# Altium schematic sheet CoreBoard1.SchDoc: MCU 1
size A4; DrawnBy: Poon Mannchun; Revision: V 3.3
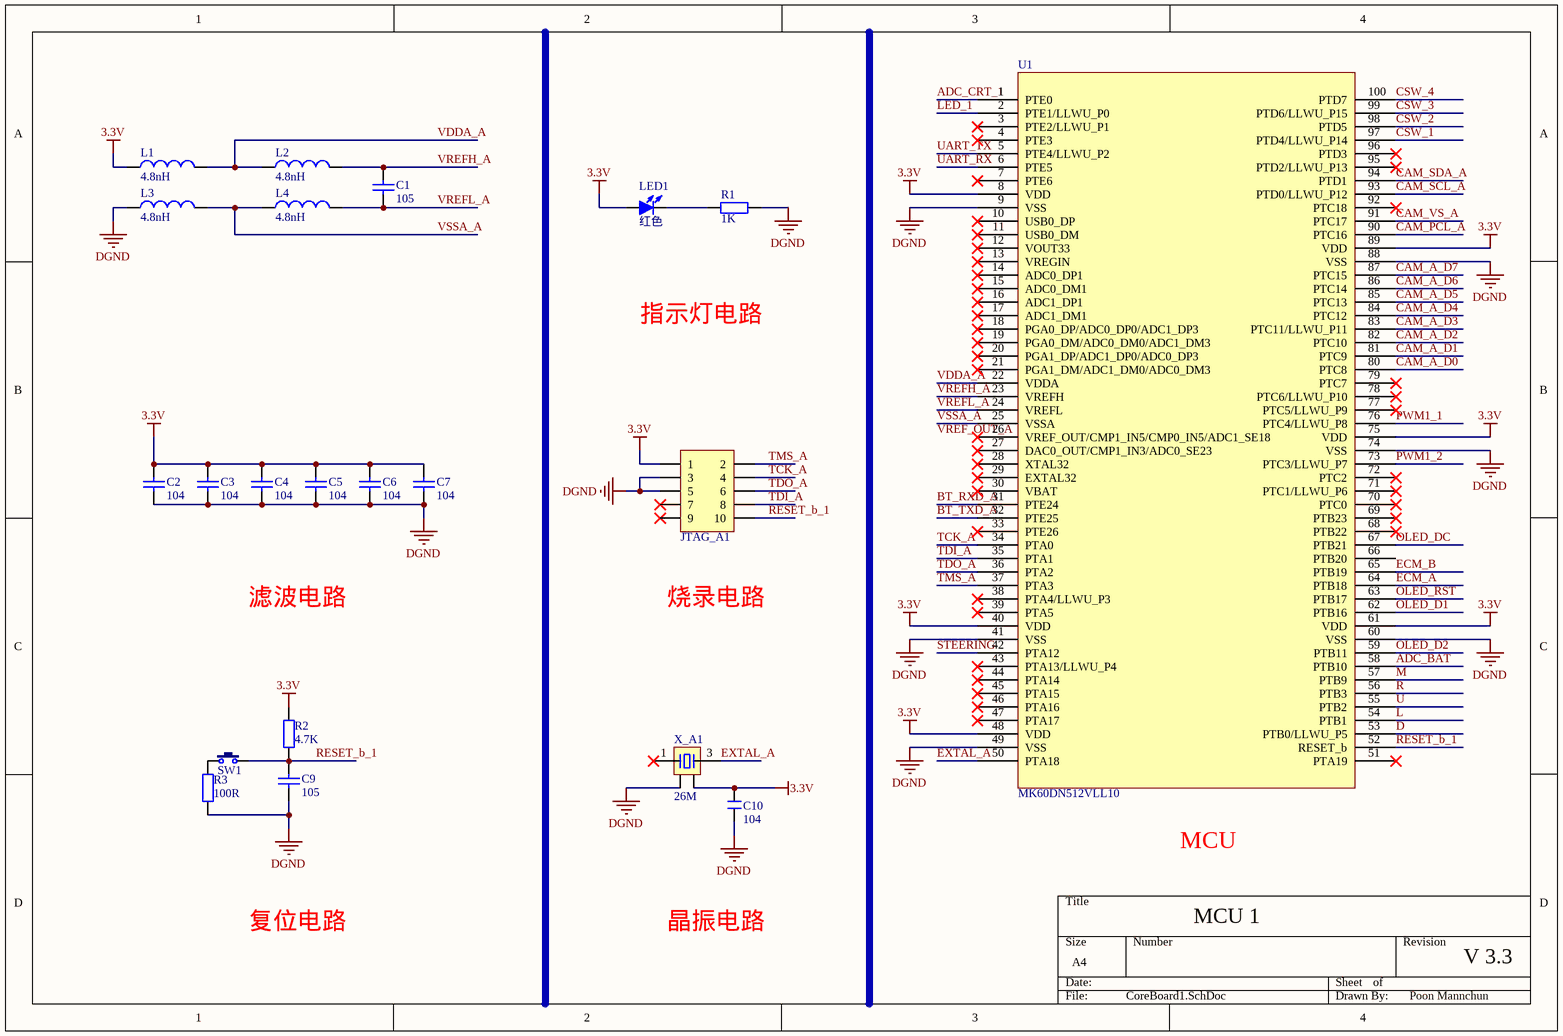
[diagram p0: CoreBoard1.SchDoc]

## Parts
C1  105  [C 0805_L]
C2  104  [C 0805_L]
C3  104  [C 0805_L]
C4  104  [C 0805_L]
C5  104  [C 0805_L]
C6  104  [C 0805_L]
C7  104  [C 0805_L]
C9  105  [C 0805_L]
C10  104  [C 0805]
JTAG_A1  Header 5X2  [HDR-5X2]  (value not drawn)
L1  4.8nH  [L 0805]
L2  4.8nH  [L 0805]
L3  4.8nH  [L 0805]
L4  4.8nH  [L 0805]
LED1  红色  [LED 0805B]
R1  1K  [R 0805_L]
R2  4.7K  [R 0805_L]
R3  100R  [R 0805_L]
SW1  3x6x5  [TSW SMD-3*6*2.5]  (value not drawn)
U1  MK60DN512VLL10  [LQFP100 14x14_N]
X_A1  26M  [OSC 5032-4P]

## Nets
3.3V: C2.2 C3.2 C4.2 C5.2 C6.2 C7.2 C10.2 JTAG_A1.1 L1.1 LED1.1(A) R2.2 U1.8(VDD) U1.40(VDD) U1.48(VDD) U1.61(VDD) U1.75(VDD) U1.89(VDD) X_A1.4
DGND: C2.1 C3.1 C4.1 C5.1 C6.1 C7.1 C9.1 C10.1 JTAG_A1.3 JTAG_A1.5 L3.1 R1.2 R3.1 U1.9(VSS) U1.41(VSS) U1.49(VSS) U1.60(VSS) U1.74(VSS) U1.88(VSS) X_A1.2
ADC_BAT: U1.58(PTB10)
ADC_CRT_1: U1.1(PTE0)
BT_RXD_A: U1.31(PTE24)
BT_TXD_A: U1.32(PTE25)
CAM_A_D0: U1.80(PTC8)
CAM_A_D1: U1.81(PTC9)
CAM_A_D2: U1.82(PTC10)
CAM_A_D3: U1.83(PTC11/LLWU_P11)
CAM_A_D4: U1.84(PTC12)
CAM_A_D5: U1.85(PTC13)
CAM_A_D6: U1.86(PTC14)
CAM_A_D7: U1.87(PTC15)
CAM_PCL_A: U1.90(PTC16)
CAM_SCL_A: U1.93(PTD0/LLWU_P12)
CAM_SDA_A: U1.94(PTD1)
CAM_VS_A: U1.91(PTC17)
CSW_1: U1.97(PTD4/LLWU_P14)
CSW_2: U1.98(PTD5)
CSW_3: U1.99(PTD6/LLWU_P15)
CSW_4: U1.100(PTD7)
D: U1.53(PTB0/LLWU_P5)
ECM_A: U1.64(PTB18)
ECM_B: U1.65(PTB19)
EXTAL_A: U1.50(PTA18) X_A1.3
L: U1.54(PTB1)
LED_1: U1.2(PTE1/LLWU_P0)
M: U1.57(PTB9)
OLED_D1: U1.62(PTB16)
OLED_D2: U1.59(PTB11)
OLED_DC: U1.67(PTB21)
OLED_RST: U1.63(PTB17)
PWM1_1: U1.76(PTC4/LLWU_P8)
PWM1_2: U1.73(PTC3/LLWU_P7)
R: U1.56(PTB3)
RESET_b_1: C9.2 JTAG_A1.10 R2.1 SW1.2 U1.52(RESET_b)
STEERING: U1.42(PTA12)
TCK_A: JTAG_A1.4 U1.34(PTA0)
TDI_A: JTAG_A1.8 U1.35(PTA1)
TDO_A: JTAG_A1.6 U1.36(PTA2)
TMS_A: JTAG_A1.2 U1.37(PTA3)
U: U1.55(PTB2)
UART_RX: U1.6(PTE5)
UART_TX: U1.5(PTE4/LLWU_P2)
VDDA_A: L1.2 L2.1 U1.22(VDDA)
VREFH_A: C1.2 L2.2 U1.23(VREFH)
VREFL_A: C1.1 L4.2 U1.24(VREFL)
VSSA_A: L3.2 L4.1 U1.25(VSSA)
NetLED1_2: LED1.2(K) R1.1
NetR3_2: R3.2 SW1.1

Not connected (* = marked no-connect by the designer): JTAG_A1 7* 9*; U1 3(PTE2/LLWU_P1)* 4(PTE3)* 7(PTE6)* 10(USB0_DP)* 11(USB0_DM)* 12(VOUT33)* 13(VREGIN)* 14(ADC0_DP1)* 15(ADC0_DM1)* 16(ADC1_DP1)* 17(ADC1_DM1)* 18(PGA0_DP/ADC0_DP0/ADC1_DP3)* 19(PGA0_DM/ADC0_DM0/ADC1_DM3)* 20(PGA1_DP/ADC1_DP0/ADC0_DP3)* 21(PGA1_DM/ADC1_DM0/ADC0_DM3)* 26(VREF_OUT/CMP1_IN5/CMP0_IN5/ADC1_SE18)* 27(DAC0_OUT/CMP1_IN3/ADC0_SE23)* 28(XTAL32)* 29(EXTAL32)* 30(VBAT)* 33(PTE26)* 38(PTA4/LLWU_P3)* 39(PTA5)* 43(PTA13/LLWU_P4)* 44(PTA14)* 45(PTA15)* 46(PTA16)* 47(PTA17)* 51(PTA19)* 66(PTB20) 68(PTB22)* 69(PTB23)* 70(PTC0)* 71(PTC1/LLWU_P6)* 72(PTC2)* 77(PTC5/LLWU_P9)* 78(PTC6/LLWU_P10)* 79(PTC7)* 92(PTC18)* 95(PTD2/LLWU_P13)* 96(PTD3)*; X_A1 1*

## Notes on the sheet
- 指示灯电路
- 滤波电路
- 烧录电路
- MCU
- 复位电路
- 晶振电路
- Labels drawn without touching a wire or pin: VREF_OUT_A

## Library data of the parts
C1-C7 C9 = CAP: Capacitor; Published: 8-Jun-2000; Revision: July-2002: Re-released for DXP Platform.; Publisher: Altium Limited
C10 = C: 无极性贴片电容; 版权归属: 源创客; BOM名称: 无极性贴片电容; 学习资源: www.ooocke.com
JTAG_A1 = Header 5X2: 5*2P接插件; 版权归属: 源创客; BOM名称: 5*2P接插件; 学习资源: www.ooocke.com
L1-L4 = Inductor: Code_IEC: 1005; Published: 8-Jun-2000; LatestRevisionDate: 17-Jul-2002; LatestRevisionNote: Re-released for DXP Platform.; PackageReference: 0402-A; Publisher: Altium Limited; Code_JEITA: 0402
LED1 = LED-SMD: 贴片LED; 版权归属: 源创客; BOM名称: 贴片LED; 学习资源: www.ooocke.com
R1-R3 = Res2: Resistor; Published: 8-Jun-2000; LatestRevisionDate: 17-Jul-2002; LatestRevisionNote: Re-released for DXP Platform.; PackageReference: AXIAL-0.4; Publisher: Altium Limited
SW1 = TSW 3x6: 3x6轻触开关; 版权归属: 源创客; BOM名称: 3x6轻触开关; 学习资源: www.ooocke.com
U1 = MK60DN512ZVLQ10: MK60DN512ZVLL10
X_A1 = XTAL-4: 4脚晶振; 版权归属: 源创客; BOM名称: 4脚晶振; 学习资源: www.ooocke.com